# EAGLE design mixiple (EAGLE 7.7.0)
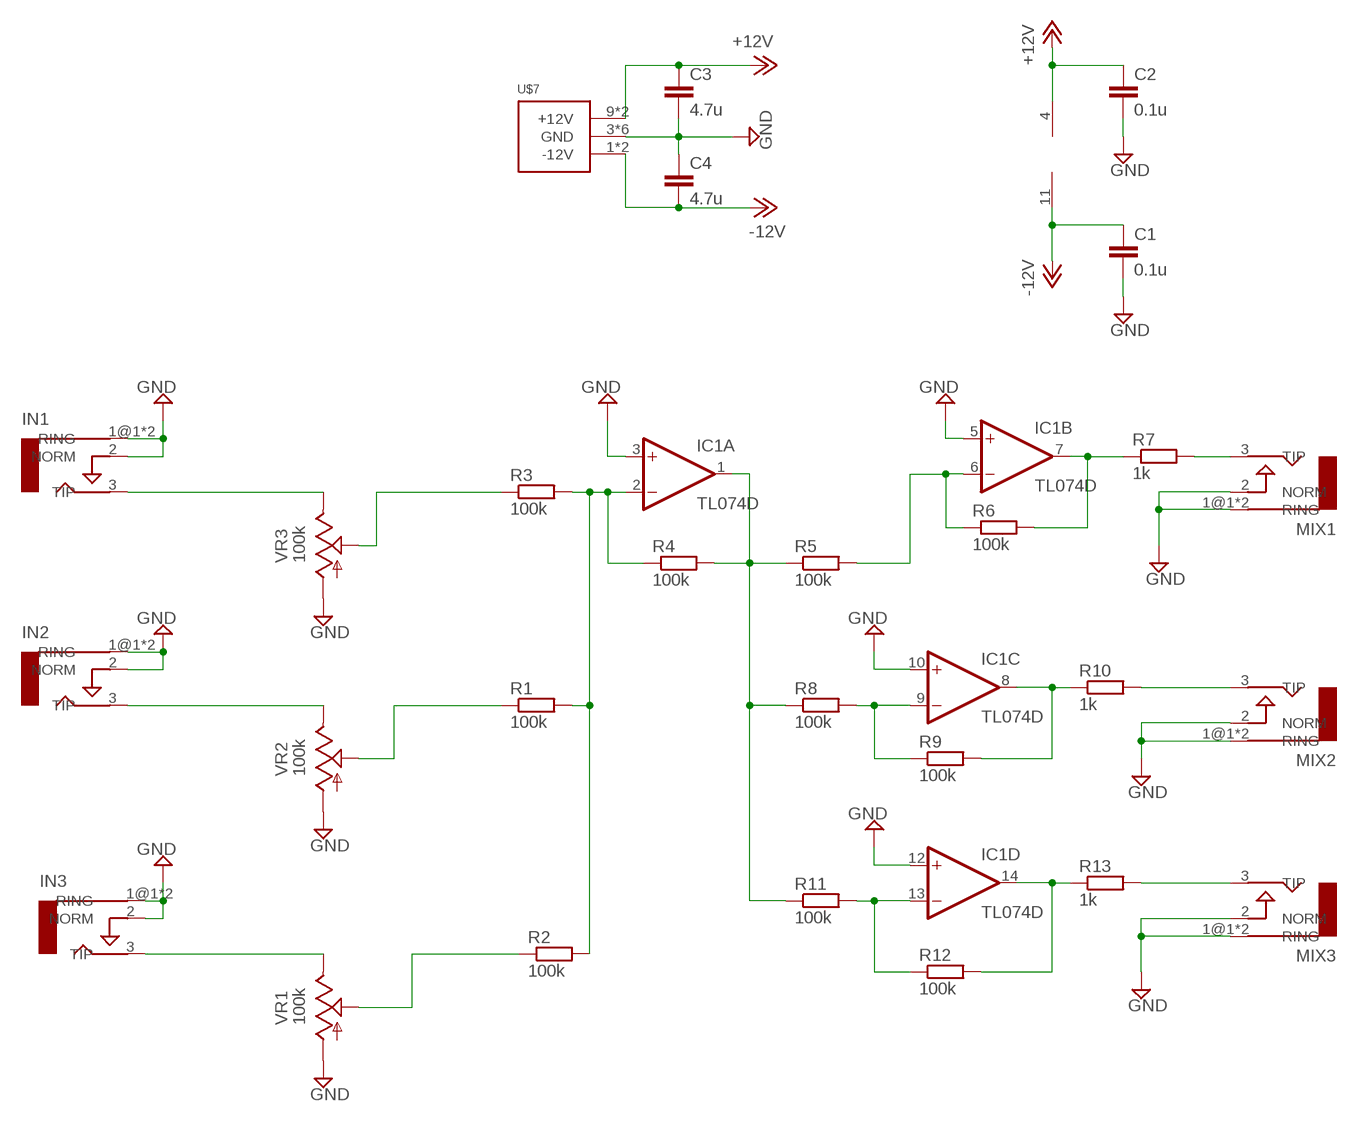
[diagram p0: schematic, sheet 1]

## Parts
C1  0.1u  C-EUC0805  [C0805]
C2  0.1u  C-EUC0805  [C0805]
C3  4.7u  C-EUC0805  [C0805]
C4  4.7u  C-EUC0805  [C0805]
IC1  TL074D  [SO14]
IN1  AUDIO-JACKERTHENVAR  [ERTHENVAR-JACK]
IN2  AUDIO-JACKERTHENVAR  [ERTHENVAR-JACK]
IN3  AUDIO-JACKERTHENVAR  [ERTHENVAR-JACK]
MIX1  AUDIO-JACKERTHENVAR  [ERTHENVAR-JACK]
MIX2  AUDIO-JACKERTHENVAR  [ERTHENVAR-JACK]
MIX3  AUDIO-JACKERTHENVAR  [ERTHENVAR-JACK]
R1  100k  R-EU_R0805  [R0805]
R2  100k  R-EU_R0805  [R0805]
R3  100k  R-EU_R0805  [R0805]
R4  100k  R-EU_R0805  [R0805]
R5  100k  R-EU_R0805  [R0805]
R6  100k  R-EU_R0805  [R0805]
R7  1k  R-EU_R0805  [R0805]
R8  100k  R-EU_R0805  [R0805]
R9  100k  R-EU_R0805  [R0805]
R10  1k  R-EU_R0805  [R0805]
R11  100k  R-EU_R0805  [R0805]
R12  100k  R-EU_R0805  [R0805]
R13  1k  R-EU_R0805  [R0805]
U$7  POWER_SIMPLE10  [POWER_10]
VR1  100k  9MM_SNAP-IN_POT_  [9MM_SNAP-IN_POT]
VR2  100k  9MM_SNAP-IN_POT_  [9MM_SNAP-IN_POT]
VR3  100k  9MM_SNAP-IN_POT_  [9MM_SNAP-IN_POT]

## Nets
+12V: C2.1 C3.1 IC1.4(P:V+) U$7.9(+12V) U$7.10(+12V)
-12V: C1.1 C4.2 IC1.11(P:V-) U$7.1(-12V) U$7.2(-12V)
GND: C1.2 C2.2 C3.2 C4.1 IC1.3(A:+IN) IC1.5(B:+IN) IC1.10(C:+IN) IC1.12(D:+IN) IN1.1@1(RING) IN1.1@2(RING) IN1.2(NORM) IN2.1@1(RING) IN2.1@2(RING) IN2.2(NORM) IN3.1@1(RING) IN3.1@2(RING) IN3.2(NORM) MIX1.1@1(RING) MIX1.1@2(RING) MIX1.2(NORM) MIX2.1@1(RING) MIX2.1@2(RING) MIX2.2(NORM) MIX3.1@1(RING) MIX3.1@2(RING) MIX3.2(NORM) U$7.3(GND) U$7.4(GND) U$7.5(GND) U$7.6(GND) U$7.7(GND) U$7.8(GND) VR1.1(A) VR2.1(A) VR3.1(A)
N$1: R2.1 VR1.2(S)
N$2: R1.1 VR2.2(S)
N$3: R3.1 VR3.2(S)
N$5: IC1.7(B:OUT) R6.2 R7.1
N$6: IC1.8(C:OUT) R9.2 R10.1
N$7: IC1.14(D:OUT) R12.2 R13.1
N$8: IC1.6(B:-IN) R5.2 R6.1
N$9: IC1.9(C:-IN) R8.2 R9.1
N$10: IC1.13(D:-IN) R11.2 R12.1
N$11: IN1.3(TIP) VR3.3(E)
N$12: IC1.2(A:-IN) R1.2 R2.2 R3.2 R4.1
N$13: IN2.3(TIP) VR2.3(E)
N$14: IN3.3(TIP) VR1.3(E)
N$15: IC1.1(A:OUT) R4.2 R5.1 R8.1 R11.1
N$17: MIX2.3(TIP) R10.2
N$18: MIX3.3(TIP) R13.2
N$19: MIX1.3(TIP) R7.2

## Library data of the parts
C1-C4 = rcl:C-EU: CAPACITOR, European symbol
IC1 = linear:TL074: OP AMP
IN1-IN3 MIX1-MIX3 = erthenvar:AUDIO-JACK: Switching Mono 3.5mm Audio Jack from Erthenvar.
R1-R13 = rcl:R-EU_: RESISTOR, European symbol
U$7 = eurorack:POWER_SIMPLE
VR1-VR3 = MusicThingModular:9MM_SNAP-IN_POT: 9mm vertical snap-in pot, Alpha / Panasonic style

## Board
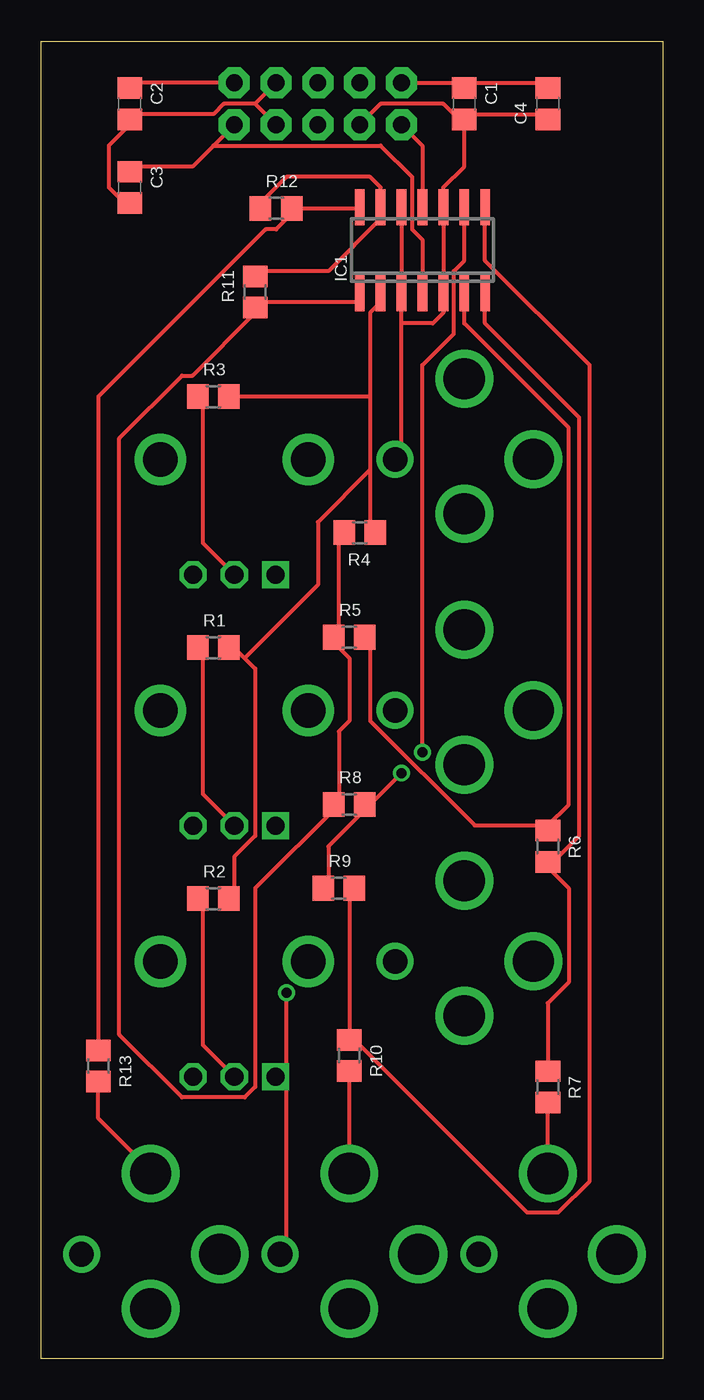
[diagram p1: board, top side]
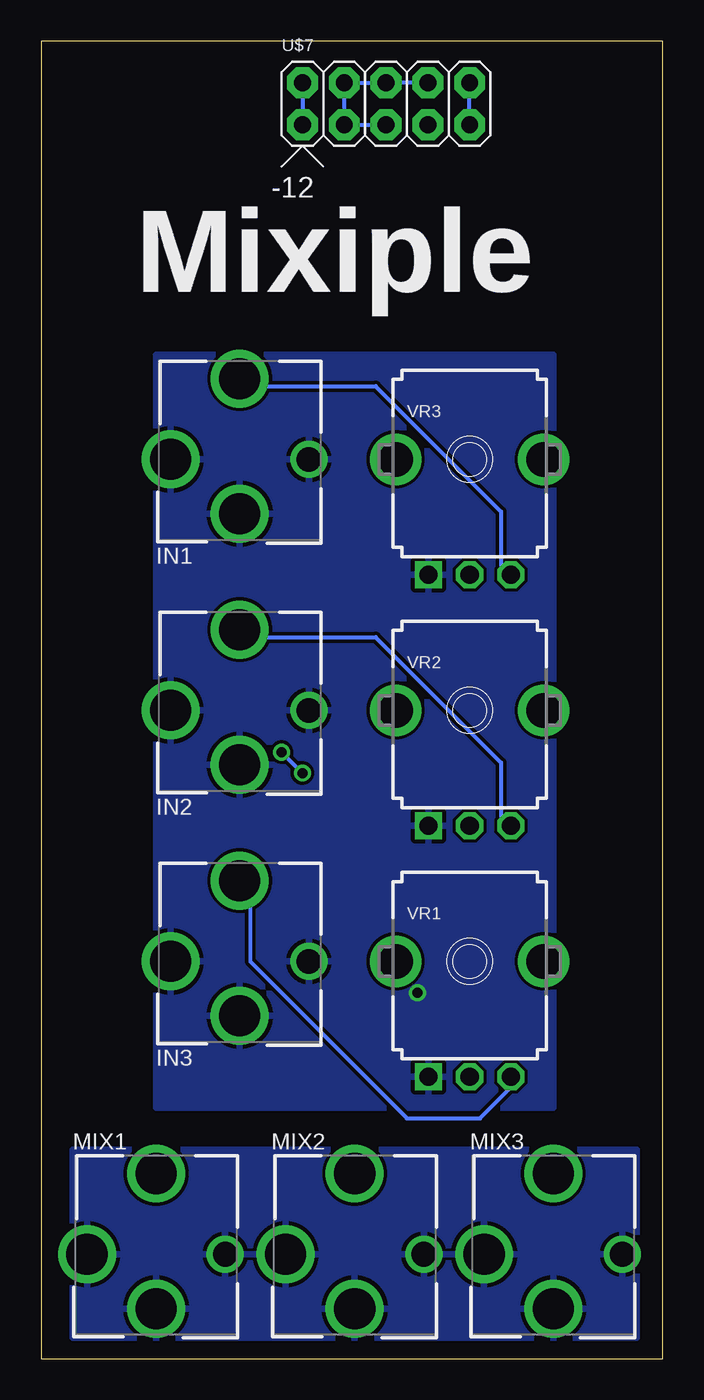
[diagram p2: board, bottom side, seen from below]

Size 37.77 x 80 mm. Coordinates in mm from the lower left corner, seen from the top.
Outline: 37.77,0 0,0 0,80 37.77,80 37.77,0
Copper layers (1*16): Top 0.035mm / dielectric 1.5mm / Bottom 0.035mm
Design rules "default": minimum track width 10mil, minimum drill 24mil, track to track 8mil, track to pad 8mil, pad to pad 8mil, via to via 8mil, smd to smd 8mil, copper to edge 40mil, drill to drill 8mil, minimum pad ring 10mil, minimum via ring 8mil, stop-mask expansion 4mil, vias tented up to drill 0mil, thermal gap 10mil

### Footprints (pad centres in the part's own frame; a part is rotated, then mirrored left to right if it is on the bottom)
C0805 = smd 1.3 x 1.5: 1 -0.95,0; 2 0.95,0
SO14 = smd 0.6 x 2.2: 1 -3.81,-2.6; 2 -2.54,-2.6; 3 -1.27,-2.6; 4 0,-2.6; 5 1.27,-2.6; 6 2.54,-2.6; 7 3.81,-2.6; 8 3.81,2.6; 9 2.54,2.6; 10 1.27,2.6; 11 0,2.6; 12 -1.27,2.6; 13 -2.54,2.6; 14 -3.81,2.6
ERTHENVAR-JACK = drill 2.5: 1@1 -4.2,0; 2 0,-3.3; 3 0,4.9 | drill 1.5: 1@2 4.2,0
R0805 = smd 1.3 x 1.5: 1 -0.95,0; 2 0.95,0
POWER_10 = drill 1.016 pad 1.88 octagon: 1 -5.08,-1.27; 2 -5.08,1.27; 3 -2.54,-1.27; 4 -2.54,1.27; 5 0,-1.27; 6 0,1.27; 7 2.54,-1.27; 8 2.54,1.27; 9 5.08,-1.27; 10 5.08,1.27
9MM_SNAP-IN_POT = drill 1.1 square: 1 -2.5,-7 | drill 1.1 octagon: 2 0,-7; 3 2.5,-7 | drill 2.1 pad 2.794: CHASSIS1 -4.5,0; CHASSIS2 4.5,0

### Placement (x,y rotation side)
C1  25.71,76.2 270 top
C2  5.38,76.2 270 top
C3  5.38,71.12 270 top
C4  30.79,76.2 90 top
IC1  23.17,67.31 0 top
IN1  25.71,54.61 0 bottom
IN2  25.71,39.37 0 bottom
IN3  25.71,24.13 0 bottom
MIX1  30.79,6.35 0 bottom
MIX2  18.72,6.35 0 bottom
MIX3  6.65,6.35 0 bottom
R1  10.46,43.18 0 top
R2  10.46,27.94 0 top
R3  10.46,58.42 0 top
R4  19.36,50.16 180 top
R5  18.72,43.81 0 top
R6  30.79,31.11 270 top
R7  30.79,16.51 270 top
R8  18.72,33.66 0 top
R9  18.09,28.57 0 top
R10  18.72,18.41 270 top
R11  13,64.77 90 top
R12  14.28,69.85 0 top
R13  3.48,17.78 270 top
U$7  16.82,76.2 0 bottom
VR1  11.73,24.13 0 bottom
VR2  11.73,39.37 0 bottom
VR3  11.73,54.61 0 bottom

### Tracks (layer width: path | path; a pad name or v marks a point on that pad's centre or on a via)
+12V
  Top 0.254: U$7.10 5.39,77.47 C2.1 | U$7.9 10.47,73.66 | 10.47,73.66 9.2,72.39 5.39,72.39 C3.1 | IC1.4 23.17,67.94 22.53,68.58 22.53,71.75 20.63,73.66 10.47,73.66
  Bottom 0.254: U$7.9 U$7.10
-12V
  Top 0.254: IC1.11 23.17,73.66 U$7.1 | 25.71,77.47 30.79,77.47 C4.2 | U$7.2 25.71,77.47 | 25.71,77.47 C1.1
  Bottom 0.254: U$7.2 U$7.1
GND  (via drill 0.61)
  Top 0.254: C3.2 5.39,70.48 4.75,70.48 4.12,71.12 4.12,73.66 5.39,74.93 C2.2 5.39,75.56 10.47,75.56 11.1,76.2 13.01,76.2 | U$7.8 13.01,76.2 | 13.01,76.2 U$7.7 | IC1.12 IC1.3 21.9,62.87 | 21.9,62.87 21.9,54.61 IN1.1@2 | C4.1 30.79,75.56 25.71,75.56 C1.2 25.71,74.93 | 25.71,74.93 25.71,72.39 24.44,71.12 IC1.10 IC1.5 24.44,63.5 23.8,62.87 21.9,62.87 | U$7.3 20.63,76.2 24.44,76.2 25.71,74.93 | v14.91,22.23 14.91,6.35 MIX2.1@2
  Bottom 0.254: U$7.5 U$7.3 U$7.4 U$7.6 U$7.8
  pour Bottom: 30.79,60.96 6.65,60.96 6.65,15.24 30.79,15.24
  pour Bottom: 35.87,12.7 1.57,12.7 1.57,1.27 35.87,1.27
N$1
  Top 0.254: R2.1 9.83,27.94 9.83,19.05 11.74,17.14 VR1.2
N$2
  Top 0.254: R1.1 9.83,43.18 9.83,34.29 11.74,32.38 VR2.2
N$3
  Top 0.254: R3.1 9.83,58.42 9.83,49.53 11.74,47.62 VR3.2
N$5
  Top 0.254: R7.1 30.79,21.59 32.06,22.86 32.06,28.57 30.79,29.84 | IC1.7 26.98,62.87 32.69,57.15 32.69,31.75 30.79,29.84 | 30.79,29.84 R6.2
N$6
  Top 0.254: 18.72,19.68 18.72,28.57 R9.2 | IC1.8 26.98,66.67 33.33,60.33 33.33,10.79 31.42,8.89 29.52,8.89 18.72,19.68 | 18.72,19.68 R10.1
N$7
  Top 0.254: R13.1 3.48,58.42 13.64,68.58 14.28,68.58 15.55,69.85 | 15.55,69.85 19.36,69.85 IC1.14 | 15.55,69.85 R12.2
N$8
  Top 0.254: 30.79,32.38 26.34,32.38 19.99,38.73 19.99,43.81 R5.2 | IC1.6 25.71,62.87 32.06,56.52 32.06,33.66 30.79,32.38 | 30.79,32.38 R6.1
N$9  (via drill 0.61)
  Top 0.254: 19.99,33.66 17.45,31.11 17.45,28.57 R9.1 | IC1.9 25.71,66.67 25.07,66.04 25.07,62.23 23.17,60.33 v23.17,36.83 | 19.99,33.66 v21.9,35.56 | 19.99,33.66 R8.2
  Bottom 0.254: v21.9,35.56 v23.17,36.83
N$10
  Top 0.254: R11.2 13.01,66.04 17.45,66.04 20.63,69.22 IC1.13 20.63,71.12 19.99,71.75 14.91,71.75 13.64,70.48 13.64,69.85 R12.1
N$11
  Bottom 0.254: VR3.3 9.83,47.62 9.83,51.44 17.45,59.05 25.71,59.05 IN1.3
N$12
  Top 0.254: 12.37,42.55 11.74,43.18 R1.2 | 12.37,42.55 13.01,41.91 13.01,31.75 11.74,30.48 11.74,27.94 R2.2 | 19.99,58.42 19.99,63.5 20.63,64.14 IC1.2 | 19.99,58.42 19.99,53.98 | 19.99,53.98 19.99,50.16 R4.1 | 19.99,58.42 R3.2 | 12.37,42.55 16.82,46.99 16.82,50.8 19.99,53.98
N$13
  Bottom 0.254: VR2.3 9.83,32.38 9.83,36.2 17.45,43.81 25.71,43.81 IN2.3
N$14
  Bottom 0.254: VR1.3 9.2,16.51 11.1,14.61 15.55,14.61 25.07,24.13 25.07,27.94 25.71,28.57 IN3.3
N$15
  Top 0.254: IC1.1 19.36,64.14 13.01,64.14 R11.1 13.01,63.5 9.2,59.69 8.56,59.69 4.75,55.88 4.75,19.68 8.56,15.88 12.37,15.88 13.01,16.51 13.01,28.57 18.09,33.66 | 18.09,33.66 18.09,38.1 18.72,38.73 18.72,42.55 17.45,43.81 R5.1 18.09,43.81 18.09,50.16 R4.2 | 18.09,33.66 R8.1
N$17
  Top 0.254: MIX2.3 R10.2
N$18
  Top 0.254: R13.2 3.48,14.61 6.66,11.43 MIX3.3
N$19
  Top 0.254: MIX1.3 R7.2

### Text on the board
bNames: Mixiple
tValues: Mixiple